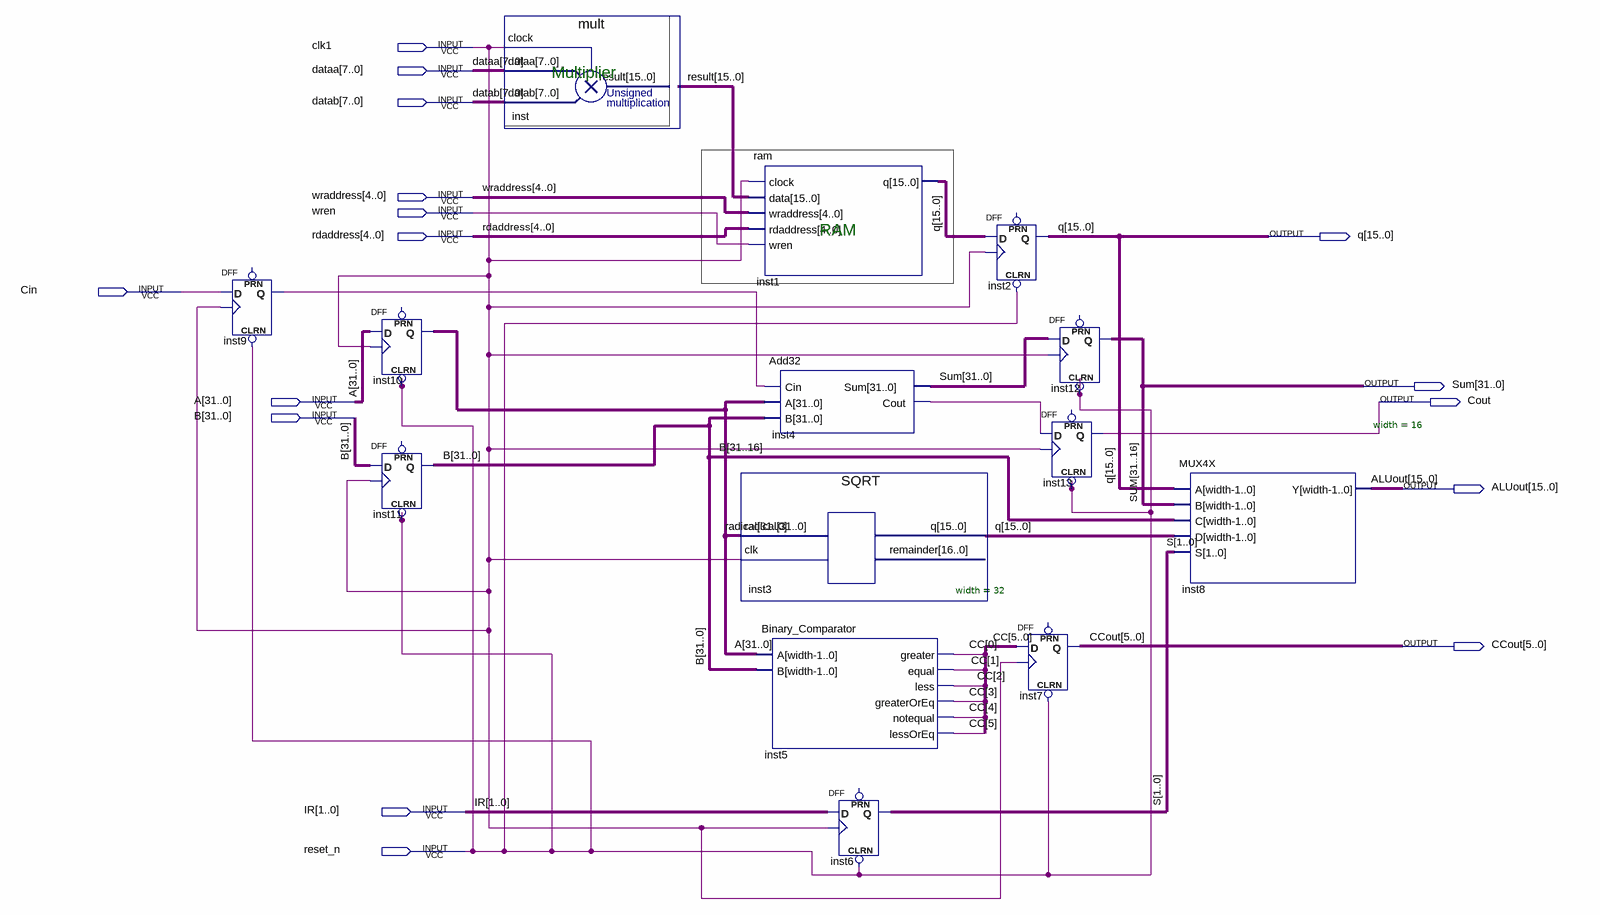
[diagram p0: schematic sheet]
// Quartus schematic pipemult.bdf as structural Verilog: 14 symbols, 16 pins
module pipemult (
  input  clk1,
  input  [7:0] dataa,
  input  [7:0] datab,
  input  [4:0] wraddress,
  input  wren,
  input  [4:0] rdaddress,
  input  Cin,
  input  [31:0] A,
  input  [31:0] B,
  input  [1:0] IR,
  input  reset_n,
  output [15:0] q,
  output [31:0] Sum,
  output Cout,
  output [15:0] ALUout,
  output [5:0] CCout
);

  wire inst4_cout, inst9_q;
  wire [1:0] S;
  wire [5:0] CC;
  wire [15:0] result;
  wire [31:0] radical;

  DFF inst9 (.CLRN(reset_n), .CLK(clk1), .D(Cin), .Q(inst9_q));  // open: PRN
  DFF inst10[31:0] (.CLRN(reset_n), .CLK(clk1), .D(A), .Q(A));  // open: PRN
  DFF inst11[31:0] (.CLRN(reset_n), .CLK(clk1), .D(B), .Q(B));  // open: PRN
  mult inst (.clock(clk1), .dataa(dataa), .datab(datab), .result(result));
  ram inst1 (.clock(clk1), .data(result), .wraddress(wraddress), .rdaddress(rdaddress), .wren(wren), .q(q));
  SQRT inst3 (.radical(radical), .clk(clk1), .q(q));  // open: remainder
  Binary_Comparator #(.width(32)) inst5 (
    .A(A), .B(B), .greater(CC[0]), .equal(CC[1]), .less(CC[2]), .greaterOrEq(CC[3]), .notequal(CC[4]),
    .lessOrEq(CC[5]));
  Add32 inst4 (.Cin(inst9_q), .A(A), .B(B), .Sum(Sum), .Cout(inst4_cout));
  DFF inst6[1:0] (.CLRN(reset_n), .CLK(clk1), .D(IR), .Q(S));  // open: PRN
  DFF inst2[15:0] (.CLRN(reset_n), .CLK(clk1), .D(q), .Q(q));  // open: PRN
  DFF inst12[31:0] (.CLRN(reset_n), .CLK(clk1), .D(Sum), .Q(Sum));  // open: PRN
  DFF inst13 (.CLRN(reset_n), .CLK(clk1), .D(inst4_cout), .Q(Cout));  // open: PRN
  DFF inst7[5:0] (.CLRN(reset_n), .CLK(clk1), .D(CC), .Q(CCout));  // open: PRN
  MUX4X #(.width(16)) inst8 (.A(q), .B(Sum[31:16]), .C(B[31:16]), .D(q), .S(S), .Y(ALUout));

  // Notes on the sheet:
  //   Multiplier
  //   RAM
endmodule
